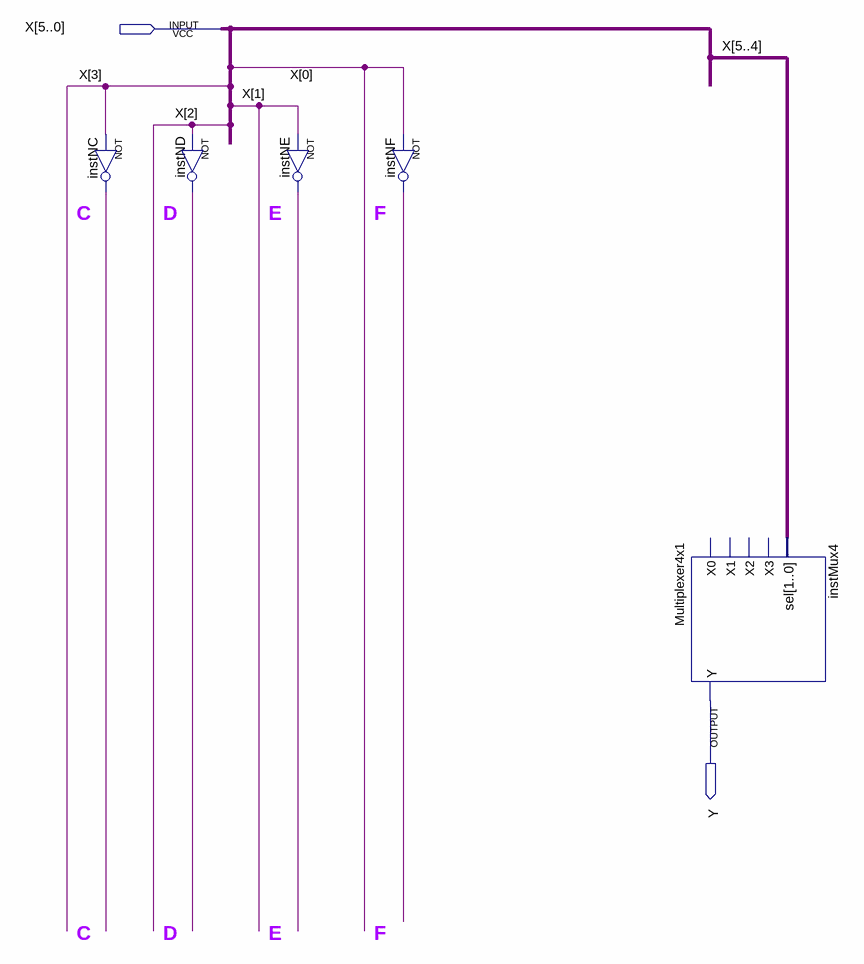
[diagram p0: schematic sheet]
// Quartus schematic MorseBDF_prototype.bdf as structural Verilog: 5 symbols, 2 pins
module MorseBDF_prototype (
  input  [5:0] X,
  output Y
);

  wire instNC_out, instND_out, instNE_out, instNF_out;

  not instNC (instNC_out, X[3]);
  not instND (instND_out, X[2]);
  not instNE (instNE_out, X[1]);
  not instNF (instNF_out, X[0]);
  Multiplexer4x1 instMux4 (.sel(X[5:4]), .Y(Y));  // open: X0, X1, X2, X3

  // Notes on the sheet:
  //   C
  //   D
  //   E
  //   F
  //   C
  //   D
  //   E
  //   F
endmodule
